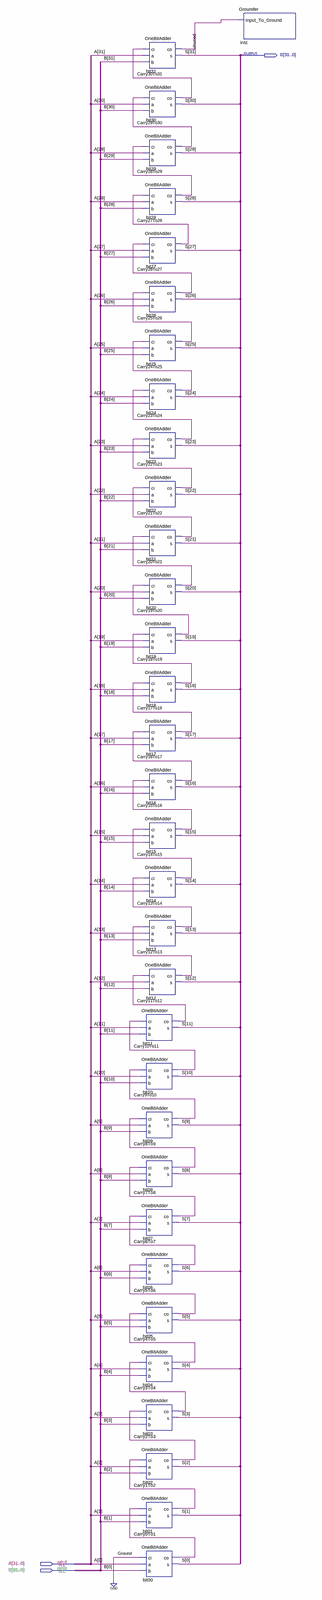
[diagram p0: schematic sheet, whole]
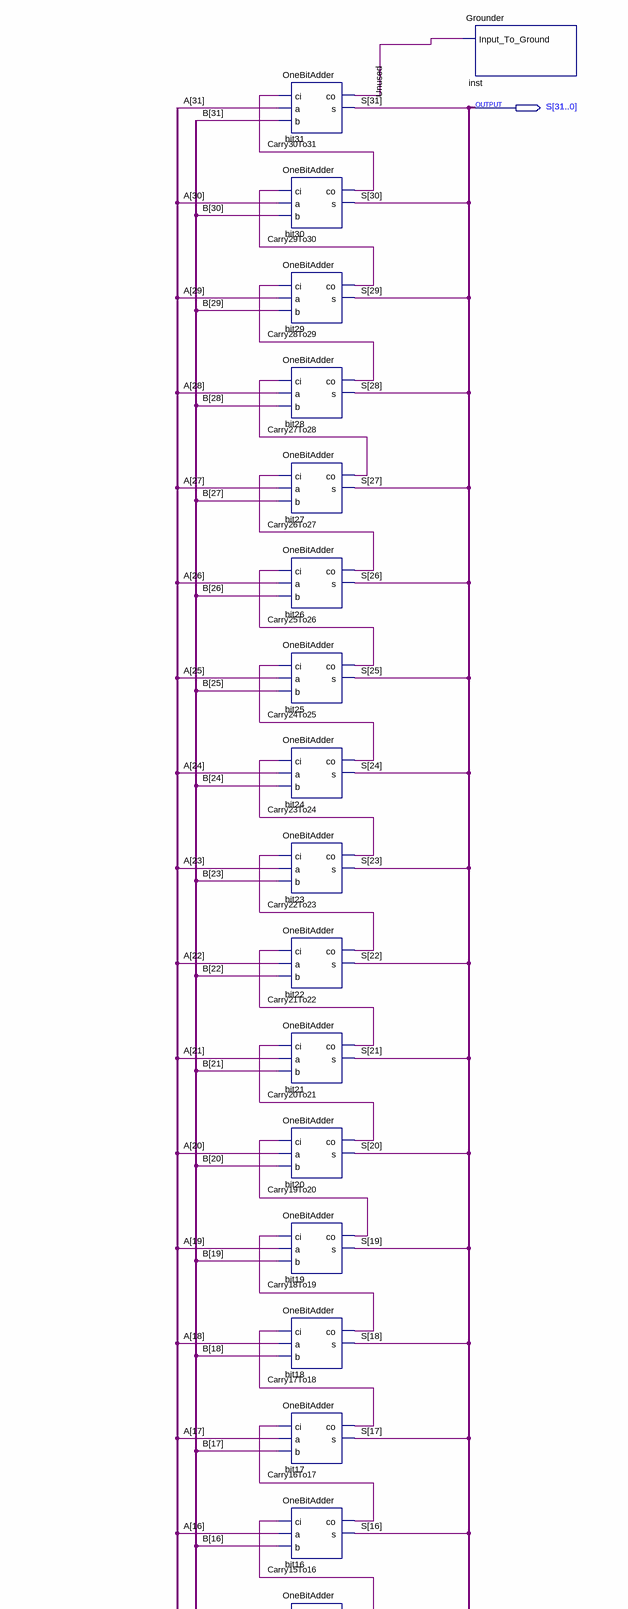
[diagram p1: schematic sheet, upper part]
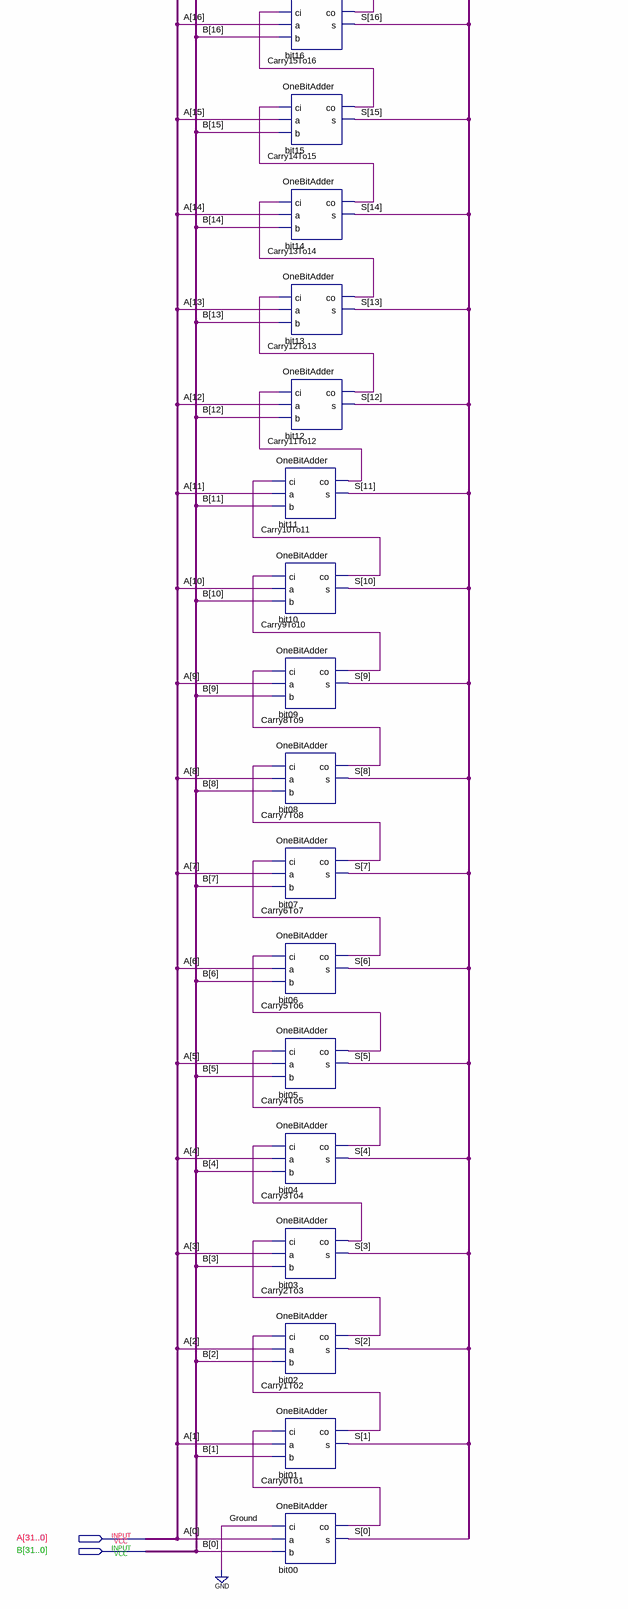
[diagram p2: schematic sheet, lower part]
// Quartus schematic Adder_32.bdf as structural Verilog: 33 symbols, 3 pins
module Adder_32 (
  input  [31:0] A,
  input  [31:0] B,
  output [31:0] S
);

  wire Carry0To1, Carry1To2, Carry2To3, Carry3To4, Carry4To5, Carry5To6, Carry6To7, Carry7To8, Carry8To9,
       Carry9To10, Carry10To11, Carry11To12, Carry12To13, Carry13To14, Carry14To15, Carry15To16, Carry16To17,
       Carry17To18, Carry18To19, Carry19To20, Carry20To21, Carry21To22, Carry22To23, Carry23To24,
       Carry24To25, Carry25To26, Carry26To27, Carry27To28, Carry28To29, Carry29To30, Carry30To31, Unused;

  OneBitAdder bit31 (.ci(Carry30To31), .a(A[31]), .b(B[31]), .co(Unused), .s(S[31]));
  OneBitAdder bit30 (.ci(Carry29To30), .a(A[30]), .b(B[30]), .co(Carry30To31), .s(S[30]));
  OneBitAdder bit29 (.ci(Carry28To29), .a(A[29]), .b(B[29]), .co(Carry29To30), .s(S[29]));
  OneBitAdder bit28 (.ci(Carry27To28), .a(A[28]), .b(B[28]), .co(Carry28To29), .s(S[28]));
  OneBitAdder bit27 (.ci(Carry26To27), .a(A[27]), .b(B[27]), .co(Carry27To28), .s(S[27]));
  OneBitAdder bit26 (.ci(Carry25To26), .a(A[26]), .b(B[26]), .co(Carry26To27), .s(S[26]));
  OneBitAdder bit25 (.ci(Carry24To25), .a(A[25]), .b(B[25]), .co(Carry25To26), .s(S[25]));
  OneBitAdder bit24 (.ci(Carry23To24), .a(A[24]), .b(B[24]), .co(Carry24To25), .s(S[24]));
  OneBitAdder bit23 (.ci(Carry22To23), .a(A[23]), .b(B[23]), .co(Carry23To24), .s(S[23]));
  OneBitAdder bit22 (.ci(Carry21To22), .a(A[22]), .b(B[22]), .co(Carry22To23), .s(S[22]));
  OneBitAdder bit21 (.ci(Carry20To21), .a(A[21]), .b(B[21]), .co(Carry21To22), .s(S[21]));
  OneBitAdder bit20 (.ci(Carry19To20), .a(A[20]), .b(B[20]), .co(Carry20To21), .s(S[20]));
  OneBitAdder bit19 (.ci(Carry18To19), .a(A[19]), .b(B[19]), .co(Carry19To20), .s(S[19]));
  OneBitAdder bit18 (.ci(Carry17To18), .a(A[18]), .b(B[18]), .co(Carry18To19), .s(S[18]));
  OneBitAdder bit17 (.ci(Carry16To17), .a(A[17]), .b(B[17]), .co(Carry17To18), .s(S[17]));
  OneBitAdder bit16 (.ci(Carry15To16), .a(A[16]), .b(B[16]), .co(Carry16To17), .s(S[16]));
  OneBitAdder bit15 (.ci(Carry14To15), .a(A[15]), .b(B[15]), .co(Carry15To16), .s(S[15]));
  OneBitAdder bit14 (.ci(Carry13To14), .a(A[14]), .b(B[14]), .co(Carry14To15), .s(S[14]));
  OneBitAdder bit13 (.ci(Carry12To13), .a(A[13]), .b(B[13]), .co(Carry13To14), .s(S[13]));
  OneBitAdder bit12 (.ci(Carry11To12), .a(A[12]), .b(B[12]), .co(Carry12To13), .s(S[12]));
  OneBitAdder bit11 (.ci(Carry10To11), .a(A[11]), .b(B[11]), .co(Carry11To12), .s(S[11]));
  OneBitAdder bit10 (.ci(Carry9To10), .a(A[10]), .b(B[10]), .co(Carry10To11), .s(S[10]));
  OneBitAdder bit09 (.ci(Carry8To9), .a(A[9]), .b(B[9]), .co(Carry9To10), .s(S[9]));
  OneBitAdder bit08 (.ci(Carry7To8), .a(A[8]), .b(B[8]), .co(Carry8To9), .s(S[8]));
  OneBitAdder bit07 (.ci(Carry6To7), .a(A[7]), .b(B[7]), .co(Carry7To8), .s(S[7]));
  OneBitAdder bit06 (.ci(Carry5To6), .a(A[6]), .b(B[6]), .co(Carry6To7), .s(S[6]));
  OneBitAdder bit05 (.ci(Carry4To5), .a(A[5]), .b(B[5]), .co(Carry5To6), .s(S[5]));
  OneBitAdder bit04 (.ci(Carry3To4), .a(A[4]), .b(B[4]), .co(Carry4To5), .s(S[4]));
  OneBitAdder bit03 (.ci(Carry2To3), .a(A[3]), .b(B[3]), .co(Carry3To4), .s(S[3]));
  OneBitAdder bit02 (.ci(Carry1To2), .a(A[2]), .b(B[2]), .co(Carry2To3), .s(S[2]));
  OneBitAdder bit01 (.ci(Carry0To1), .a(A[1]), .b(B[1]), .co(Carry1To2), .s(S[1]));
  OneBitAdder bit00 (.ci(1'b0), .a(A[0]), .b(B[0]), .co(Carry0To1), .s(S[0]));
  Grounder inst (.Input_To_Ground(Unused));
endmodule
